# Altium schematic sheet GSM Power LED Driver.SchDoc: GSM Power LED Driver
size 292 x 193 mm; SheetNumber: 31; SheetTotal: 40
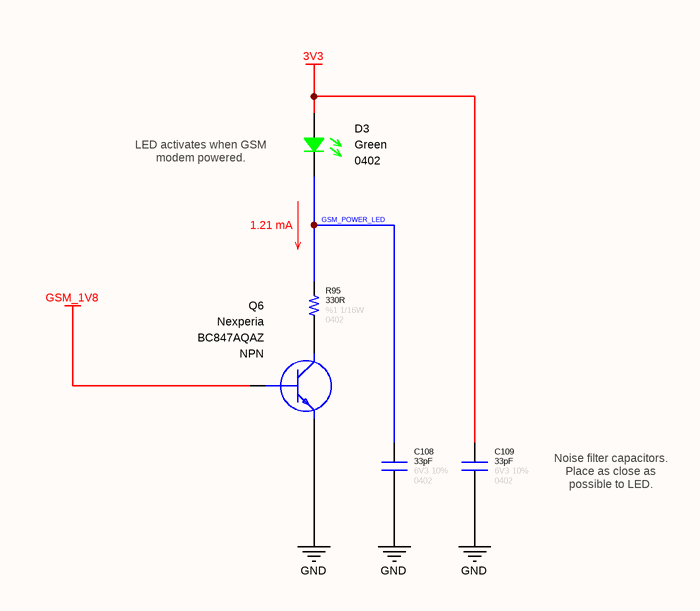
[diagram p0: GSM Power LED Driver.SchDoc]

## Parts
C108  value 33pF  Tolerance: 10%  Case: 0402  Voltage: 6V3  [CAPACITOR_0402]  (hidden comment: Capacitor - 33pF [0402] (Ceramic))
C109  value 33pF  Tolerance: 10%  Case: 0402  Voltage: 6V3  [CAPACITOR_0402]  (hidden comment: Capacitor - 33pF [0402] (Ceramic))
D3  Case: 0402  Color: Green  [LED_0402]  (hidden comment: SMD LED (Green))
Q6  Manufacturer Name: Nexperia  Polarity: NPN  [SOT1215]  (hidden comment: BC847AQAZ)
R95  value 330R  Case: 0402  Tolerance: %1  Power: 1/16W  [RESISTOR_0402]  (hidden comment: 330R - 0402 - %1 - 1/16W)

## Nets
3V3: C109.2 D3.2
GND: C108.1 C109.1 Q6.2(E)
GSM_1V8: Q6.1(B)
GSM_POWER_LED: C108.2 D3.1 R95.2
NetQ6_3: Q6.3(C) R95.1

## Notes on the sheet
- (near D3) LED activates when GSM modem powered.
- 1.21 mA
- Noise filter capacitors. Place as close as possible to LED.
- © 2022 All rights reserved.
  This document may not, in whole or in part, be copied, photocopied, reproduced, translated or converted to any electronic or machine readable from without prior written permission of Mehmet Günce Akkoyun.
  Engineer contact : akkoyun@me.com
- Property of
- Engineer :
- Date :
- Size :
- A4
- Time :
- Project :
- Page :
- /
- Customer :
- Product ID :
- Module ID :
- Version :
- File :
- Revision :

## Library data of the parts
C108 C109 = Capacitor - 33pF [0402-6V3]: Manufacturer Name: Kemet; Manufacturer Part Number: C0402C330J9RACAUTO; ComponentLink1Description: DataSheet; ComponentLink1URL: https://api.kemet.com/component-edge/download/datasheet/C0402C330J9RACAUTO.pdf; ComponentLink2Description: Mouser; ComponentLink2URL: https://www.mouser.com/Search/Refine.aspx?Keyword=80-C0402C330J9RAUTO
D3 = Diode - LED (0402-Green): Standard LEDs - SMD MINI-MOLD ULTRA COMPACT GREEN; Manufacturer Name: ROHM Semiconductor; Manufacturer Part Number: SML-P12MTT86R; ROHS: Yes; ComponentLink1Description: DataSheet; ComponentLink1URL: https://www.mouser.com.tr/datasheet/2/348/sml-p1-e-1139198.pdf; ComponentLink2Description: Mouser; ComponentLink2URL: https://www.mouser.com.tr/ProductDetail/ROHM-Semiconductor/SML-P12U2TT86R?qs=sGAEpiMZZMseGfSY3csMkRIBDsfU3UCXJTULB5gem9Ta%252Bp%252BvZ709fg%3D%3D
Q6 = Transistor - BC847: Bipolar NPN Transistors; Case: DFN-1010D-3; Manufacturer Part Number: BC847AQAZ
R95 = Resistor - 330R [0402]: Thick Film Resistors - SMD 1/16 W 330 Ohm 1%; Manufacturer Name: Vishay; Manufacturer Part Number: CRCW0402330RFKED; ComponentLink1Description: DataSheet; ComponentLink1URL: https://www.mouser.com.tr/datasheet/2/427/dcrcwe3-1762152.pdf; ComponentLink2Description: Mouser; ComponentLink2URL: https://www.mouser.com.tr/ProductDetail/Vishay-Dale/CRCW0402330RFKED?qs=sGAEpiMZZMu61qfTUdNhG2DpbjADlD3GGS6SwBlLi5Q%3D